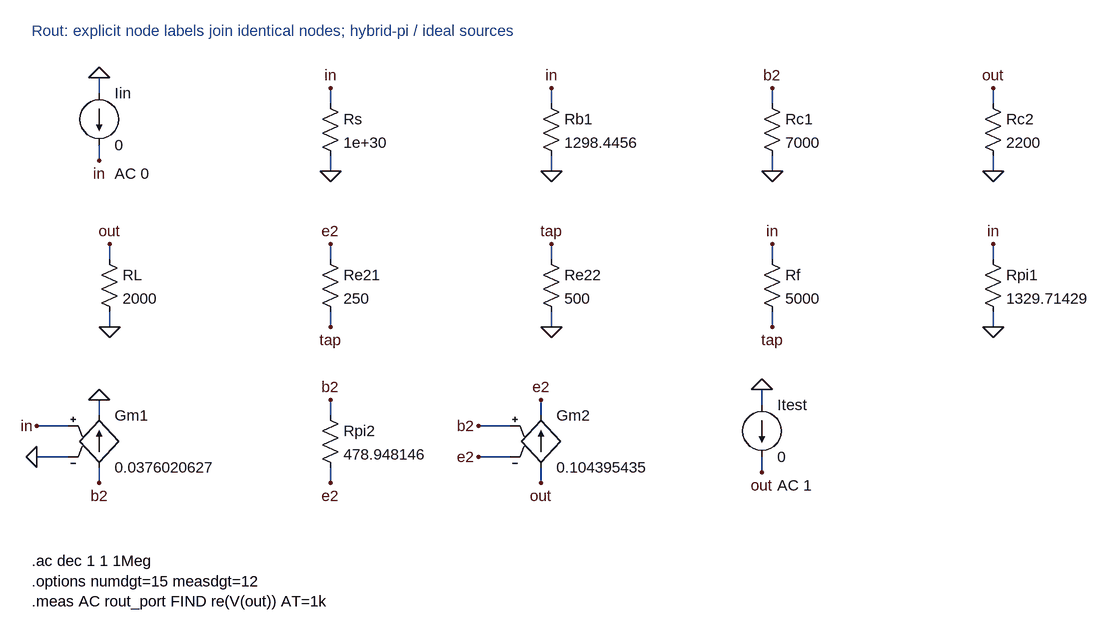
[diagram p0: schematic Rout.asc]
Rout.asc, the LTspice schematic file:
Version 4
SHEET 1 1800 1500
TEXT 16 -48 Left 2 ;Rout: explicit node labels join identical nodes; hybrid-pi / ideal sources
WIRE 120 48 120 24
FLAG 120 24 0
WIRE 120 128 120 152
FLAG 120 152 in
SYMBOL current 120 48 R0
SYMATTR InstName Iin
WINDOW 123 24 124 Left 2
SYMATTR Value 0
SYMATTR Value2 AC 0
WIRE 476 64 476 40
FLAG 476 40 in
WIRE 476 144 476 168
FLAG 476 168 0
SYMBOL res 460 48 R0
SYMATTR InstName Rs
SYMATTR Value 1e+30
WIRE 816 64 816 40
FLAG 816 40 in
WIRE 816 144 816 168
FLAG 816 168 0
SYMBOL res 800 48 R0
SYMATTR InstName Rb1
SYMATTR Value 1298.4456
WIRE 1156 64 1156 40
FLAG 1156 40 b2
WIRE 1156 144 1156 168
FLAG 1156 168 0
SYMBOL res 1140 48 R0
SYMATTR InstName Rc1
SYMATTR Value 7000
WIRE 1496 64 1496 40
FLAG 1496 40 out
WIRE 1496 144 1496 168
FLAG 1496 168 0
SYMBOL res 1480 48 R0
SYMATTR InstName Rc2
SYMATTR Value 2200
WIRE 136 304 136 280
FLAG 136 280 out
WIRE 136 384 136 408
FLAG 136 408 0
SYMBOL res 120 288 R0
SYMATTR InstName RL
SYMATTR Value 2000
WIRE 476 304 476 280
FLAG 476 280 e2
WIRE 476 384 476 408
FLAG 476 408 tap
SYMBOL res 460 288 R0
SYMATTR InstName Re21
SYMATTR Value 250
WIRE 816 304 816 280
FLAG 816 280 tap
WIRE 816 384 816 408
FLAG 816 408 0
SYMBOL res 800 288 R0
SYMATTR InstName Re22
SYMATTR Value 500
WIRE 1156 304 1156 280
FLAG 1156 280 in
WIRE 1156 384 1156 408
FLAG 1156 408 tap
SYMBOL res 1140 288 R0
SYMATTR InstName Rf
SYMATTR Value 5000
WIRE 1496 304 1496 280
FLAG 1496 280 in
WIRE 1496 384 1496 408
FLAG 1496 408 0
SYMBOL res 1480 288 R0
SYMATTR InstName Rpi1
SYMATTR Value 1329.71429
WIRE 120 624 120 648
FLAG 120 648 b2
WIRE 120 544 120 520
FLAG 120 520 0
WIRE 72 560 24 560
FLAG 24 560 in
WIRE 72 608 24 608
FLAG 24 608 0
SYMBOL g 120 528 R0
SYMATTR InstName Gm1
SYMATTR Value 0.0376020627
WIRE 476 544 476 520
FLAG 476 520 b2
WIRE 476 624 476 648
FLAG 476 648 e2
SYMBOL res 460 528 R0
SYMATTR InstName Rpi2
SYMATTR Value 478.948146
WIRE 800 624 800 648
FLAG 800 648 out
WIRE 800 544 800 520
FLAG 800 520 e2
WIRE 752 560 704 560
FLAG 704 560 b2
WIRE 752 608 704 608
FLAG 704 608 e2
SYMBOL g 800 528 R0
SYMATTR InstName Gm2
SYMATTR Value 0.104395435
WIRE 1140 528 1140 504
FLAG 1140 504 0
WIRE 1140 608 1140 632
FLAG 1140 632 out
SYMBOL current 1140 528 R0
SYMATTR InstName Itest
WINDOW 123 24 124 Left 2
SYMATTR Value 0
SYMATTR Value2 AC 1
TEXT 16 768 Left 2 !.ac dec 1 1 1Meg\n.options numdgt=15 measdgt=12\n.meas AC rout_port FIND re(V(out)) AT=1k

The netlist it stands for:
* Rout.asc
Iin 0 in 0 AC 0
Rs in 0 1e+30
Rb1 in 0 1298.4456
Rc1 b2 0 7000
Rc2 out 0 2200
RL out 0 2000
Re21 e2 tap 250
Re22 tap 0 500
Rf in tap 5000
Rpi1 in 0 1329.71429
Gm1 b2 0 in 0 0.0376020627
Rpi2 b2 e2 478.948146
Gm2 out e2 b2 e2 0.104395435
Itest 0 out 0 AC 1
* Rout: explicit node labels join identical nodes; hybrid-pi / ideal sources
.ac dec 1 1 1Meg
.options numdgt=15 measdgt=12
.meas AC rout_port FIND re(V(out)) AT=1k
.backanno
.end

* Results of the author's LTspice run, read from the files saved beside the schematic
* From the log:
*   rout_port: re(V(out))=(60.4040677218dB,0°) at 1000